# Altium project Project Kraken (The Ultimate ESP32-S3 dev board).PrjPcb (part 1 of 5)
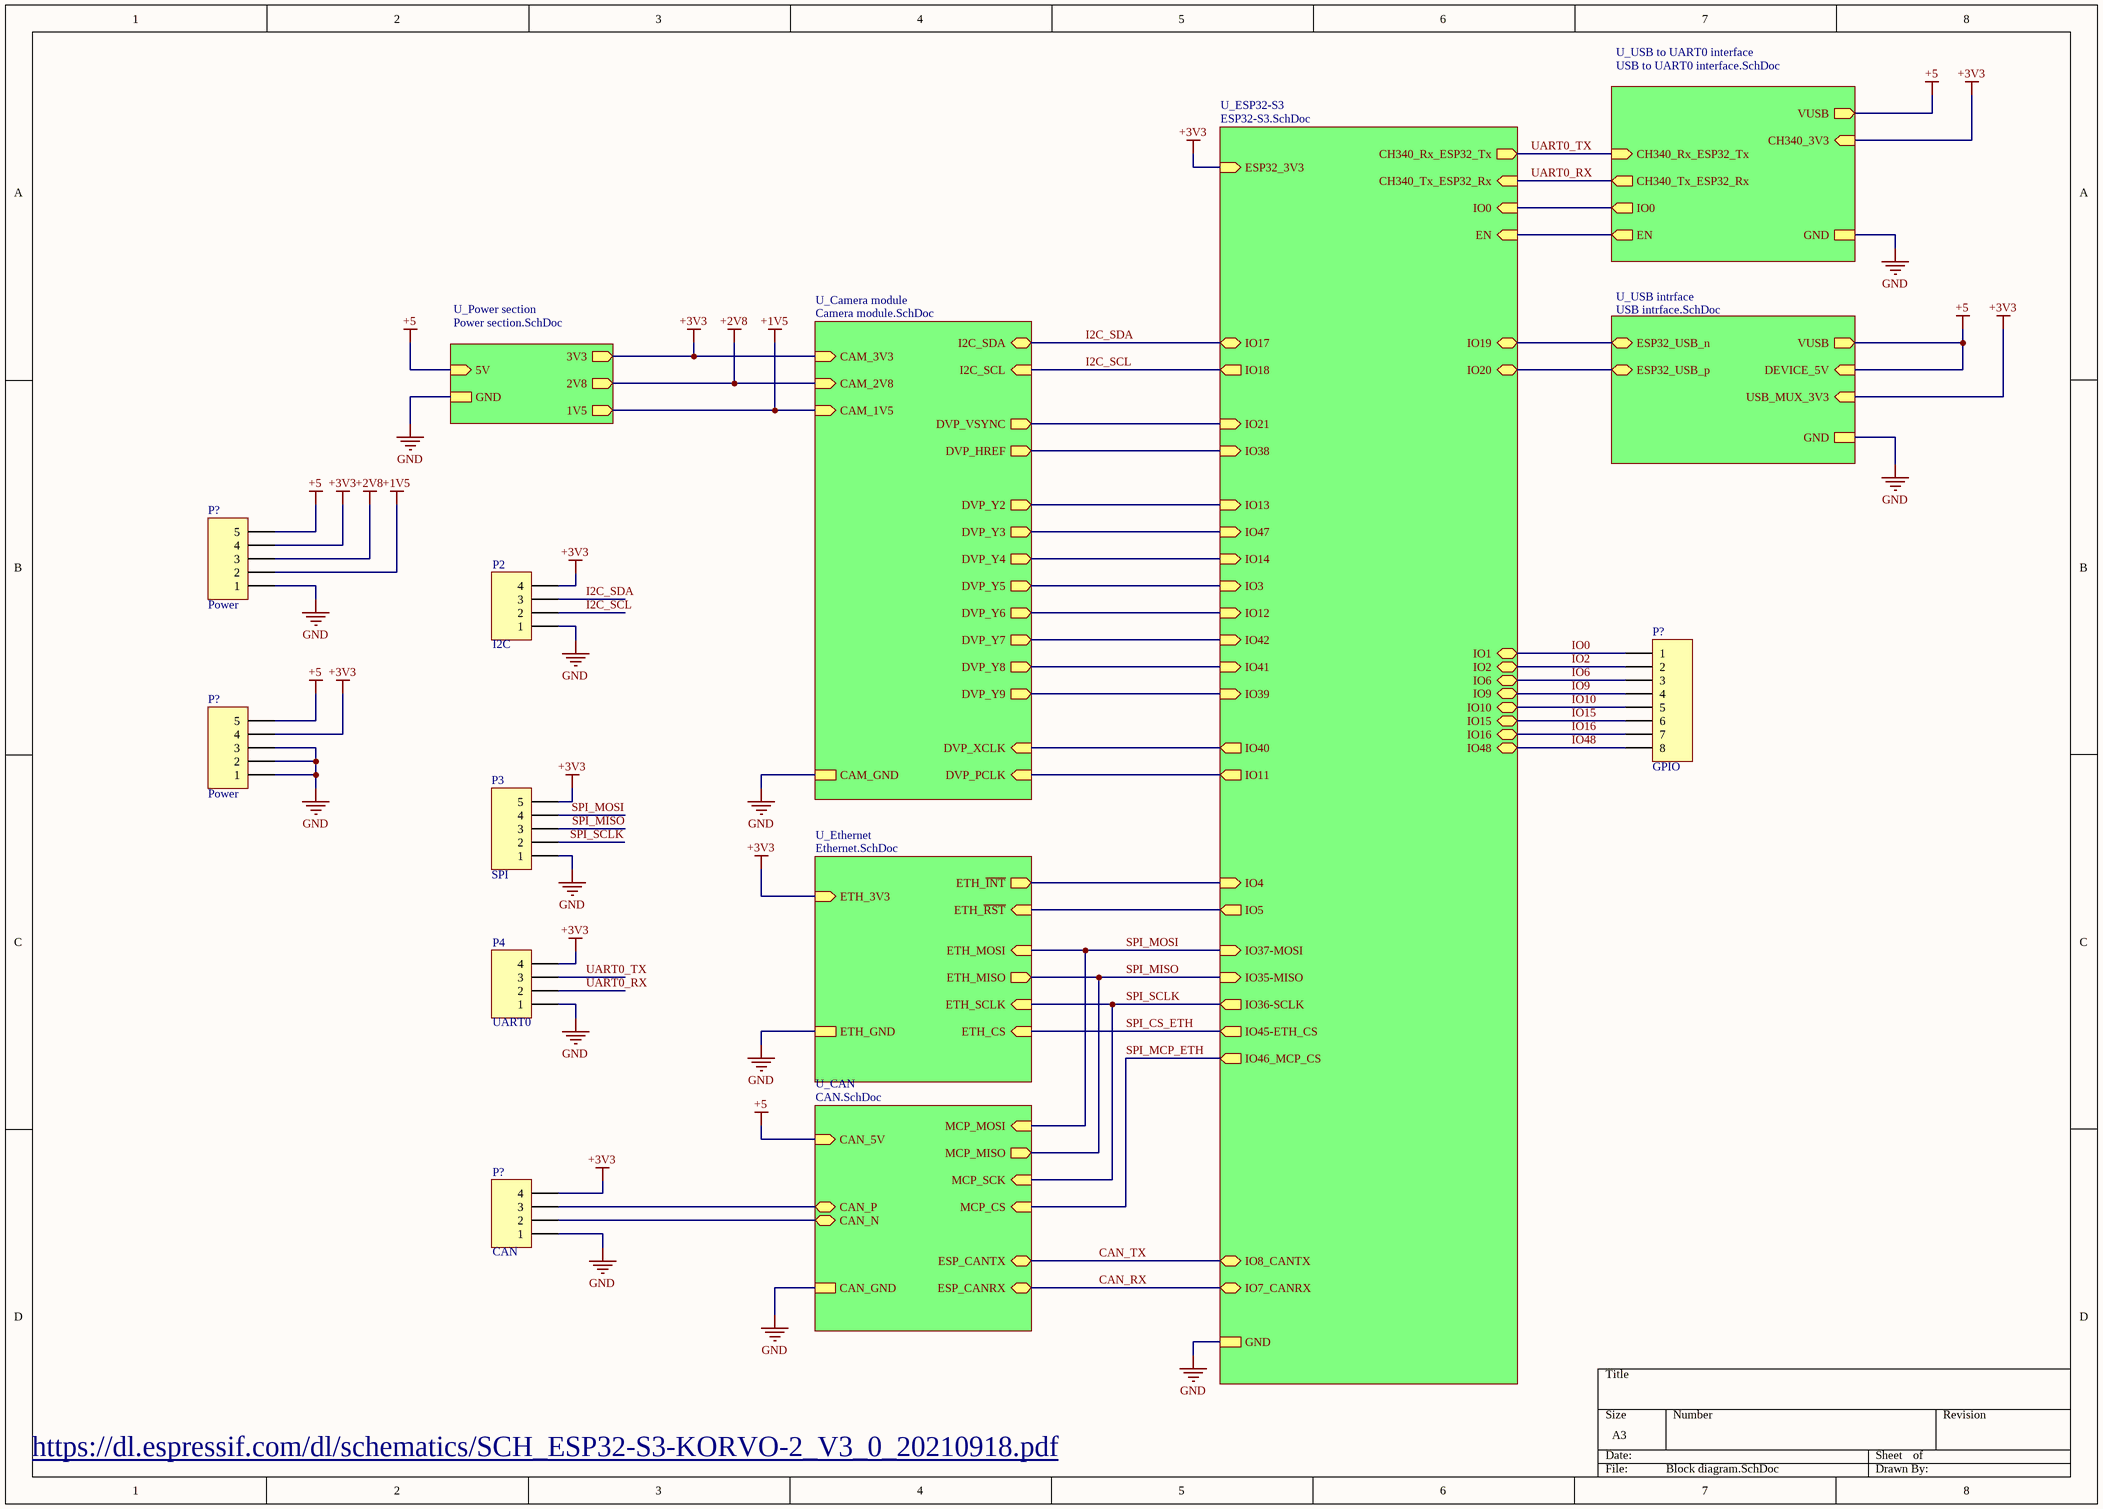
[diagram p0: Block diagram.SchDoc]
9 sheets, 156 parts. Net scope: hierarchical (ports join the sheet entries above them; power ports are global).
Board file: PCB1.PcbDoc
Sheets:
  Block diagram.SchDoc
    U_USB intrface = USB intrface.SchDoc
    U_Camera module = Camera module.SchDoc
    U_ESP32-S3 = ESP32-S3.SchDoc
    U_Power section = Power section.SchDoc
    U_Ethernet = Ethernet.SchDoc
    U_CAN = CAN.SchDoc
    U_USB to UART0 interface = USB to UART0 interface.SchDoc
  DAC.SchDoc

## Sheet Block diagram.SchDoc
size A3; SheetNumber: 1; SheetTotal: 9

### Parts
(Parts that share a designator on the sheet are numbered #1, #2 ... from top to bottom, then left to right.)
P2  I2C  [Header 2.54X4]
P3  SPI  [Header 2.54X5]
P4  UART0  [Header 2.54X4]
P?#1  Power  [Header 2.54X5]
P?#2  GPIO  [Header 2.54X8]
P?#3  Power  [Header 2.54X5]
P?#4  CAN  [Header 2.54X4]

### Sub-sheets
U_Camera module = Camera module.SchDoc: I2C_SDA (bidir), I2C_SCL (in), DVP_VSYNC (out), DVP_HREF (out), DVP_Y9 (out), DVP_XCLK (in), DVP_Y8 (out), DVP_Y7 (out), DVP_PCLK (in), DVP_Y6 (out), DVP_Y2 (out), DVP_Y5 (out), DVP_Y3 (out), DVP_Y4 (out), CAM_2V8 (in), CAM_GND, CAM_1V5 (in), CAM_3V3 (in)
U_CAN = CAN.SchDoc: MCP_SCK (in), MCP_MOSI (in), MCP_MISO (out), MCP_CS (in), ESP_CANTX (bidir), ESP_CANRX (bidir), CAN_5V (in), CAN_GND, CAN_P (bidir), CAN_N (bidir)
U_ESP32-S3 = ESP32-S3.SchDoc: CH340_Tx_ESP32_Rx (in), CH340_Rx_ESP32_Tx (out), IO1 (bidir), IO2 (bidir), IO3 (in), IO4 (in), IO5 (out), IO6 (bidir), IO7_CANRX (bidir), IO8_CANTX (bidir), IO9 (bidir), IO10 (bidir), IO11 (out), IO12 (in), IO13 (in), IO14 (in), IO15 (bidir), IO16 (bidir), EN (in), IO17 (bidir), IO18 (out), IO19 (bidir), IO20 (bidir), IO21 (in), IO35-MISO (in), IO36-SCLK (out), IO37-MOSI (in), IO38 (in), IO39 (in), IO40 (out), IO41 (in), IO42 (in), IO45-ETH_CS (out), IO46_MCP_CS (out), IO47 (in), IO48 (bidir), IO0 (in), GND, ESP32_3V3 (in)
U_Ethernet = Ethernet.SchDoc: ETH_~{RST} (in), ETH_~{INT} (out), ETH_MOSI (in), ETH_MISO (out), ETH_SCLK (in), ETH_CS (in), ETH_3V3 (in), ETH_GND
U_Power section = Power section.SchDoc: 2V8 (out), GND, 1V5 (out), 3V3 (out), 5V (in)
U_USB intrface = USB intrface.SchDoc: ESP32_USB_n (bidir), ESP32_USB_p (bidir), VUSB (out), GND, USB_MUX_3V3 (in), DEVICE_5V (in)
U_USB to UART0 interface = USB to UART0 interface.SchDoc: CH340_Tx_ESP32_Rx (out), CH340_Rx_ESP32_Tx (in), EN (out), IO0 (out), VUSB (out), GND, CH340_3V3 (in)

### Nets
+1V5: P?#1.2 ; sheet U_Camera module/CAM_1V5, sheet U_Power section/1V5
+2V8: P?#1.3 ; sheet U_Camera module/CAM_2V8, sheet U_Power section/2V8
+3V3: P2.4 P3.5 P4.4 P?#1.4 P?#3.4 P?#4.4 ; sheet U_USB intrface/USB_MUX_3V3, sheet U_Camera module/CAM_3V3, sheet U_ESP32-S3/ESP32_3V3, sheet U_Power section/3V3, sheet U_Ethernet/ETH_3V3, sheet U_USB to UART0 interface/CH340_3V3
+5: P?#1.5 P?#3.5 ; sheet U_USB intrface/VUSB, sheet U_USB intrface/DEVICE_5V, sheet U_Power section/5V, sheet U_CAN/CAN_5V, sheet U_USB to UART0 interface/VUSB
GND: P2.1 P3.1 P4.1 P?#1.1 P?#3.1 P?#3.2 P?#3.3 P?#4.1 ; sheet U_USB intrface/GND, sheet U_Camera module/CAM_GND, sheet U_ESP32-S3/GND, sheet U_Power section/GND, sheet U_Ethernet/ETH_GND, sheet U_CAN/CAN_GND, sheet U_USB to UART0 interface/GND
CAN_n: P?#4.2 ; sheet U_CAN/CAN_N
CAN_p: P?#4.3 ; sheet U_CAN/CAN_P
CAN_RX: sheet U_ESP32-S3/IO7_CANRX, sheet U_CAN/ESP_CANRX
CAN_TX: sheet U_ESP32-S3/IO8_CANTX, sheet U_CAN/ESP_CANTX
DVP_HREF: sheet U_Camera module/DVP_HREF, sheet U_ESP32-S3/IO38
DVP_PCLK: sheet U_Camera module/DVP_PCLK, sheet U_ESP32-S3/IO11
DVP_VSYNC: sheet U_Camera module/DVP_VSYNC, sheet U_ESP32-S3/IO21
DVP_XCLK: sheet U_Camera module/DVP_XCLK, sheet U_ESP32-S3/IO40
DVP_Y2: sheet U_Camera module/DVP_Y2, sheet U_ESP32-S3/IO13
DVP_Y3: sheet U_Camera module/DVP_Y3, sheet U_ESP32-S3/IO47
DVP_Y4: sheet U_Camera module/DVP_Y4, sheet U_ESP32-S3/IO14
DVP_Y5: sheet U_Camera module/DVP_Y5, sheet U_ESP32-S3/IO3
DVP_Y6: sheet U_Camera module/DVP_Y6, sheet U_ESP32-S3/IO12
DVP_Y7: sheet U_Camera module/DVP_Y7, sheet U_ESP32-S3/IO42
DVP_Y8: sheet U_Camera module/DVP_Y8, sheet U_ESP32-S3/IO41
DVP_Y9: sheet U_Camera module/DVP_Y9, sheet U_ESP32-S3/IO39
EN: sheet U_ESP32-S3/EN, sheet U_USB to UART0 interface/EN
ESP32_USB_n: sheet U_USB intrface/ESP32_USB_n, sheet U_ESP32-S3/IO19
ESP32_USB_p: sheet U_USB intrface/ESP32_USB_p, sheet U_ESP32-S3/IO20
ETH_~{INT}: sheet U_ESP32-S3/IO4, sheet U_Ethernet/ETH_~{INT}
ETH_~{RST}: sheet U_ESP32-S3/IO5, sheet U_Ethernet/ETH_~{RST}
I2C_SCL: P2.2 ; sheet U_Camera module/I2C_SCL, sheet U_ESP32-S3/IO18
I2C_SDA: P2.3 ; sheet U_Camera module/I2C_SDA, sheet U_ESP32-S3/IO17
IO0: P?#2.1 ; sheet U_ESP32-S3/IO1
IO0: sheet U_ESP32-S3/IO0, sheet U_USB to UART0 interface/IO0  [a separate net that carries the same name]
IO2: P?#2.2 ; sheet U_ESP32-S3/IO2
IO6: P?#2.3 ; sheet U_ESP32-S3/IO6
IO9: P?#2.4 ; sheet U_ESP32-S3/IO9
IO10: P?#2.5 ; sheet U_ESP32-S3/IO10
IO15: P?#2.6 ; sheet U_ESP32-S3/IO15
IO16: P?#2.7 ; sheet U_ESP32-S3/IO16
IO48: P?#2.8 ; sheet U_ESP32-S3/IO48
SPI_CS_ETH: sheet U_ESP32-S3/IO45-ETH_CS, sheet U_Ethernet/ETH_CS  [project net ETH_CS]
SPI_MCP_ETH: sheet U_ESP32-S3/IO46_MCP_CS, sheet U_CAN/MCP_CS  [project net IO46]
SPI_MISO: P3.3 ; sheet U_ESP32-S3/IO35-MISO, sheet U_Ethernet/ETH_MISO, sheet U_CAN/MCP_MISO  [project net ETH_MISO]
SPI_MOSI: P3.4 ; sheet U_ESP32-S3/IO37-MOSI, sheet U_Ethernet/ETH_MOSI, sheet U_CAN/MCP_MOSI  [project net ETH_MOSI]
SPI_SCLK: P3.2 ; sheet U_ESP32-S3/IO36-SCLK, sheet U_Ethernet/ETH_SCLK, sheet U_CAN/MCP_SCK  [project net ETH_SCLK]
UART0_RX: P4.2 ; sheet U_ESP32-S3/CH340_Tx_ESP32_Rx, sheet U_USB to UART0 interface/CH340_Tx_ESP32_Rx  [project net CH340_Tx_ESP32_Rx]
UART0_TX: P4.3 ; sheet U_ESP32-S3/CH340_Rx_ESP32_Tx, sheet U_USB to UART0 interface/CH340_Rx_ESP32_Tx  [project net CH340_Rx_ESP32_Tx]

### Notes on the sheet
- https://dl.espressif.com/dl/schematics/SCH_ESP32-S3-KORVO-2_V3_0_20210918.pdf

### Library data of the parts
P2 P4 P?#4 = Connector Pinheader 1x4: Header_4x1
P3 P?#1 P?#3 = Connector Pinheader 1x5: Header_5x1
P?#2 = Connector Pinheader 1x8: Header_8x1

## Sheet USB intrface.SchDoc
size A3; SheetNumber: 4; SheetTotal: 9
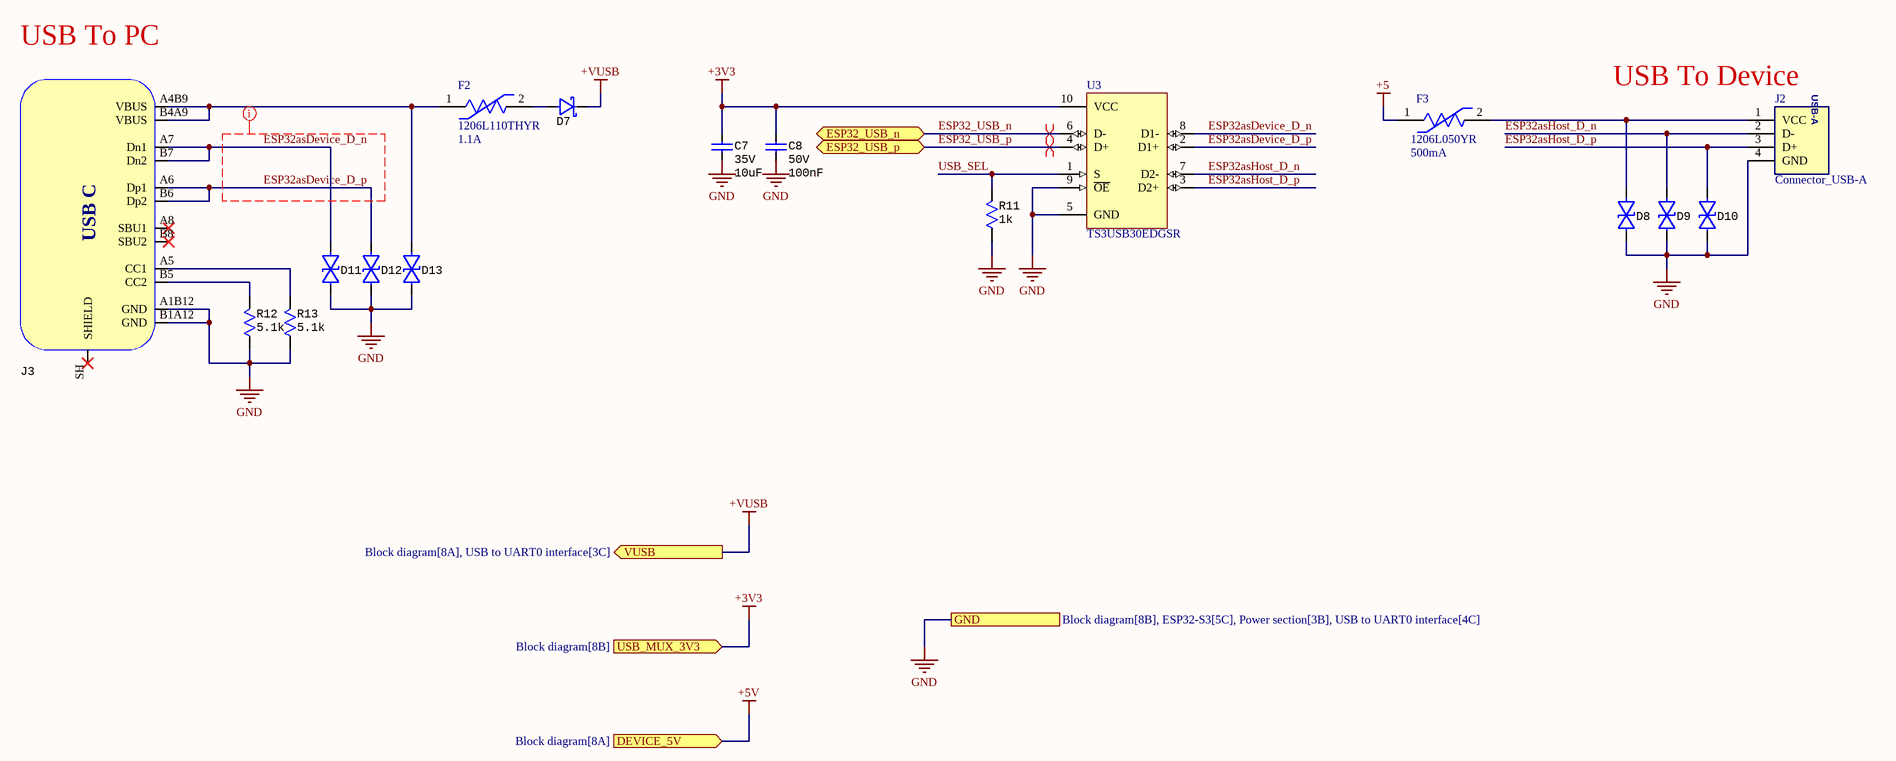
[diagram p1: USB intrface.SchDoc]

### Parts
C7  Voltage: 35V  [CAP Ceramic SMD 0603]  (hidden comment: 10uF)
C8  Voltage: 50V  [CAP Ceramic SMD 0603]  (hidden comment: 100nF)
D7  (no value)  [Diode Single SMD SOD123]
D8  (no value)  [Diode Single SMD SOD523]
D9  (no value)  [Diode Single SMD SOD523]
D10  (no value)  [Diode Single SMD SOD523]
D11  (no value)  [Diode Single SMD SOD523]
D12  (no value)  [Diode Single SMD SOD523]
D13  (no value)  [Diode Single SMD SOD523]
F2  1206L110THYR  Hold Current: 1.1A  [FUSE-1206]
F3  1206L050YR  Hold Current: 500mA  [FUSE-1206]
J2  Connector_USB-A  [USB-A/S_A]
J3  Connector_USB_Type_C_12Pin  [USB-C-31-M-12 (12PIN)]  (value not drawn)
R11  value 1k  [RES SMD 0603]  (hidden comment: 1kR)
R12  value 5.1k  [RES SMD 0603]  (hidden comment: 5.1kR)
R13  value 5.1k  [RES SMD 0603]  (hidden comment: 5.1kR)
U3  TS3USB30EDGSR  [VSSOP-10 _N]

### Ports
DEVICE_5V (in, see Block diagram[8A]), ESP32_USB_n (bidir, see Block diagram[7A]), ESP32_USB_p (bidir, see Block diagram[7A]), GND (see Block diagram[8B], ESP32-S3[5C], Power section[3B], USB to UART0 interface[4C]), USB_MUX_3V3 (in, see Block diagram[8B]), VUSB (out, see Block diagram[8A], USB to UART0 interface[3C])

### Nets
+3V3: C7.1 C8.1 U3.10(VCC) ; port USB_MUX_3V3
+5: D7.2 F3.1 ; port VUSB, port DEVICE_5V  [also labelled +5V, +VUSB]
GND: C7.2 C8.2 D8.1 D9.1 D10.1 D11.1 D12.1 D13.1 J2.4(GND) J3.A1B12(GND) J3.B1A12(GND) R11.1 R12.1 R13.1 U3.5(GND) U3.9(~{OE}) ; port GND
ESP32_USB_n: U3.6(D-) ; port ESP32_USB_n
ESP32_USB_p: U3.4(D+) ; port ESP32_USB_p
ESP32asDevice_D_n: D11.2 J3.A7(Dn1) J3.B7(Dn2) U3.8(D1-)
ESP32asDevice_D_p: D12.2 J3.A6(Dp1) J3.B6(Dp2) U3.2(D1+)
ESP32asHost_D_n: D9.2 J2.2(D-) U3.7(D2-)
ESP32asHost_D_p: D10.2 J2.3(D+) U3.3(D2+)
USB_SEL: R11.2 U3.1(S)
NetD7_1: D7.1 F2.2
NetD8_2: D8.2 F3.2 J2.1(VCC)
NetD13_2: D13.2 F2.1 J3.A4B9(VBUS) J3.B4A9(VBUS)
NetJ3_A5: J3.A5(CC1) R13.2
NetJ3_B5: J3.B5(CC2) R12.2

Not connected (* = marked no-connect by the designer): J3 A8(SBU1)* B8(SBU2)* SH(SHIELD)*

### Layout directives
differential pair: ESP32_USB_n, ESP32_USB_p
net class Diff90Ohm: ESP32asDevice_D_n, ESP32asDevice_D_p

### Notes on the sheet
- USB To PC
- (near J2) USB To Device
- (in symbol Connector_USB-A) USB-A
- (in symbol Connector_USB_Type_C_12Pin) USB C

### Library data of the parts
C7 = CAP 0603 10uF 35V: Cap Ceramic 10uF 35V X5R 20% Pad SMD 0603 85C T/R; Manufacturer: Murata; Manufacturer Part Number: GRM188R6YA106MA73D; Supplier 1: LCSC; RoHS: Yes; Category: Ceramic Capacitors; Mount: Surface Mount; Case/Package: 0603; Case Code (Metric): 1608; Case Code (Imperial): 0603; Min Operating Temperature: -55°C; Max Operating Temperature: 85°C; Packaging: Tape and Reel; Capacitance: 10uF; Voltage Rating: 35V; Tolerance: 20%; Dielectric: X5R; Voltage Rating (DC): 35V; Length: 0.063inch; Width: 0.031inch; Thickness: 0.039inch; RoHS Compliant: Yes; ComponentLink1URL: http://search.murata.co.jp/Ceramy/image/img/A01X/G101/ENG/GRM188R6YA106MA73-01.pdf?src-supplier=Future+Electronics; ComponentLink1Description: http://search.murata.co.jp/Ceramy/image/img/A01X/G101/ENG/GRM188R6YA106MA73-01.pdf?src-supplier=Future+Electronics; ComponentLink2URL: http://search.murata.co.jp/Ceramy/image/img/A01X/G101/ENG/GRM188R6YA106MA73-01.pdf?src-supplier=Digi-Key; ComponentLink2Description: http://search.murata.co.jp/Ceramy/image/img/A01X/G101/ENG/GRM188R6YA106MA73-01.pdf?src-supplier=Digi-Key; ComponentLink3URL: https://www.murata.com/~/media/webrenewal/support/library/catalog/products/capacitor/mlcc/c02e.ashx?la=en-us&src-supplier=Digi-Key; ComponentLink3Description: https://www.murata.com/~/media/webrenewal/support/library/catalog/products/capacitor/mlcc/c02e.ashx?la=en-us&src-supplier=Digi-Key; ComponentLink4URL: http://search.murata.co.jp/Ceramy/image/img/A01X/G101/ENG/GRM188R6YA106MA73-01.pdf?src-supplier=Mouser; ComponentLink4Description: http://search.murata.co.jp/Ceramy/image/img/A01X/G101/ENG/GRM188R6YA106MA73-01.pdf?src-supplier=Mouser; ComponentLink5URL: http://search.murata.co.jp/Ceramy/image/img/A01X/G101/ENG/GRM188R6YA106MA73-01.pdf?src-supplier=TTI; ComponentLink5Description: http://search.murata.co.jp/Ceramy/image/img/A01X/G101/ENG/GRM188R6YA106MA73-01.pdf?src-supplier=TTI; Supplier Part Number 1: C194427; Value: 10uF
C8 = CAP 0603 100nF 50V: Multilayer Ceramic Capacitors MLCC Surface Mount 0603 0.1uF 50 Volts X7R 10%; Manufacturer: Murata; Manufacturer Part Number: GRM188R71H104KA93D; Insulation Resistance: 10GR; Supplier 1: LCSC; RoHS: Yes; Category: Ceramic Capacitors; Stock 1: 3546650; Pricing 1: 50=0.00420, 500=0.00330, 1500=0.00290, 5000=0.00260, 25000=0.00250, 50000=0.00240 (USD); Mount: Surface Mount; Case/Package: 0603; Number of Pins: 2; Case Code (Imperial): 0603; Case Code (Metric): 1608; Dielectric Material: Ceramic; Material: Ceramic; Contact Plating: Tin,Matte; Min Operating Temperature: -55°C; Max Operating Temperature: 125°C; Capacitance: 100nF; Tolerance: 10%; Packaging: Tape and Reel; Dielectric: X7R; Voltage Rating (DC): 50V; Termination: SMD/SMT; Package Quantity: 1; Voltage Rating: 50V; Length: 1.6mm; Width: 0.8mm; Height: 0.8mm; Depth: 0.8mm; Thickness: 0.035inch; Radiation Hardening: No; RoHS Compliant: Yes; REACH SVHC: No SVHC; Lead Free: Lead Free; ComponentLink1URL: https://datasheet.ciiva.com/19467/1857604-19467681.pdf?src-supplier=Jameco; ComponentLink1Description: https://datasheet.ciiva.com/19467/1857604-19467681.pdf?src-supplier=Jameco; ComponentLink2URL: https://datasheet.ciiva.com/11786/0900766b807a1cab-11786047.pdf?src-supplier=RSComponents; ComponentLink2Description: https://datasheet.ciiva.com/11786/0900766b807a1cab-11786047.pdf?src-supplier=RSComponents; ComponentLink3URL: https://datasheet.ciiva.com/29201/451744-da-01-en-vs-kondensator-0603-29201904.pdf?src-supplier=Conrad; ComponentLink3Description: https://datasheet.ciiva.com/29201/451744-da-01-en-vs-kondensator-0603-29201904.pdf?src-supplier=Conrad; ComponentLink4URL: https://datasheet.ciiva.com/7937/4360-7937659.pdf?src-supplier=Element14; ComponentLink4Description: https://datasheet.ciiva.com/7937/4360-7937659.pdf?src-supplier=Element14; ComponentLink5URL: https://datasheet.ciiva.com/14116/nmgrm-data-en-14116602.pdf?src-supplier=Distrelec; ComponentLink5Description: https://datasheet.ciiva.com/14116/nmgrm-data-en-14116602.pdf?src-supplier=Distrelec; ComponentLink6URL: https://datasheet.ciiva.com/48436/nmgrm-data-en-48436667.pdf?src-supplier=Distrelec; ComponentLink6Description: https://datasheet.ciiva.com/48436/nmgrm-data-en-48436667.pdf?src-supplier=Distrelec; ComponentLink7URL: https://datasheet.ciiva.com/28534/4360-28534245.pdf?src-supplier=Element14; ComponentLink7Description: https://datasheet.ciiva.com/28534/4360-28534245.pdf?src-supplier=Element14; ComponentLink8URL: https://datasheet.ciiva.com/131/partnumbering-e-01-131739.pdf?src-supplier=Digi-Key; ComponentLink8Description: https://datasheet.ciiva.com/131/partnumbering-e-01-131739.pdf?src-supplier=Digi-Key; ComponentLink9URL: https://datasheet.ciiva.com/131/partnumbering-e-01-131738.pdf?src-supplier=Digi-Key; ComponentLink9Description: https://datasheet.ciiva.com/131/partnumbering-e-01-131738.pdf?src-supplier=Digi-Key; ComponentLink10URL: https://datasheet.ciiva.com/131/partnumbering-e-01-131740.pdf?src-supplier=Digi-Key; ComponentLink10Description: https://datasheet.ciiva.com/131/partnumbering-e-01-131740.pdf?src-supplier=Digi-Key; ComponentLink11URL: https://datasheet.ciiva.com/7937/1747470-7937658.pdf?src-supplier=Element14; ComponentLink11Description: https://datasheet.ciiva.com/7937/1747470-7937658.pdf?src-supplier=Element14; Supplier Part Number 1: C77055; Value: 100nF
D7 = B5819W: 40V 600mV@1A 1A SOD-123 Schottky Barrier Diodes (SBD) ROHS; Manufacturer: MCC; Manufacturer Part Number: B5819W-TP; Element Configuration: Single; Forward Voltage: 550mV; Max Reverse Voltage (DC): 20V; Max Forward Surge Current (Ifsm): 10A; Max Reverse Current: 1mA; Max Power Dissipation: 250mW; Supplier 1: LCSC; RoHS: Yes; Category: Rectifier Diodes; Stock 1: 8570; Pricing 1: 10=0.04150, 100=0.03440, 300=0.03090, 3000=0.02820, 6000=0.02610, 9000=0.02500 (USD); Mount: Surface Mount; Min Operating Temperature: -65°C; Max Operating Temperature: 125°C; Package Quantity: 3000; Packaging: Tape and Reel; Average Rectified Current: 1A; Series: -; Reverse Voltage (DC): 40V; Forward Current: 1A; Max Repetitive Reverse Voltage (Vrrm): 40V; RoHS Compliant: Yes; ComponentLink1URL: https://datasheet.ciiva.com/6378/b5817w-b5819wsod-123-6378255.pdf?src-supplier=Digi-Key; ComponentLink1Description: https://datasheet.ciiva.com/6378/b5817w-b5819wsod-123-6378255.pdf?src-supplier=Digi-Key; Supplier Part Number 1: C84354
D8-D13 = LESD5D5.0CT1G: Bi-Directional 9.4A 5V 18.6V 5.6V SOD-523 ESD Protection Devices ROHS; Manufacturer: UMW(Youtai Semiconductor); Supplier 1: LCSC; Manufacturer Part Number: LESD5D5.0CT1G; RoHS: No; Category: Uncategorized; Stock 1: 13940; Pricing 1: 20=0.02140, 200=0.01710, 600=0.01470, 3000=0.01330, 9000=0.01330, 21000=0.01330 (USD); Supplier Part Number 1: C5199850
F2 = 1206L110THYR: PTC RESET FUSE 8V 1.1A 1206; Manufacturer: Littelfuse; Trip Time: 0.1s; Trip Current: 2.2A; Value: 0.04-0.21Ω; Current Rating: 100A; Voltage Rating: 8V; Device Class L3: unset; Manufacturer Part Number: 1206L110THYR; ComponentLink2URL: https://m.littelfuse.com/~/media/electronics/datasheets/resettable_ptcs/littelfuse_ptc_1206l_datasheet.pdf.pdf; Height: 0.6mm; Temperature Range Low: -40°C; Automotive: No; Device Class L2: PTC Resettable Fuses; Device Class L1: Circuit Protection; Digikey Description: PTC RESET FUSE 8V 1.1A 1206; Octopart: https://octopart.com/1206l110thyr-littelfuse-11800142; Temperature Range High: +85°C; Category: Fuse; RoHS: TRUE; Ambient Temperature Range Low: -40°C; Mouser Description: Resettable Fuses - PPTC PTC 8V 1206 1.1A POLYFUSE SMD THIN; ComponentLink2Description: Datasheet; Ambient Temperature Range High: +85°C; Lead Free: Yes; Resistance: 0.04-0.21Ω; Temperature: -40°C to +85°C; Package: 1206L
F3 = 1206L050YR: PTC RESET FUSE 6V 500MA 1206; Trip Current: 1A; Current Rating: 100A; Resistance: 700mR; Approvals: cULus; Max Power Dissipation: 600mW; Time to Trip: 0.1s; Min Operating Temperature: -40°C; Voltage Rating (DC): 6V; Working Voltage: 6V; Package Quantity: 4000; Termination: SMD/SMT; Lead Free: Lead Free; REACH SVHC: No SVHC; Series: 1206L; Max Voltage Rating (DC): 6V; Height: 0.75mm; Terminal Material: Copper; Packaging: Tape and Reel; Case Code (Imperial): 1206; Length: 3.4mm; RoHS Compliant: Yes; Operating Supply Voltage: 6V; Case Code (Metric): 3216; Width: 1.8mm; Max Current Rating: 100A; Case/Package: 1206; Power Dissipation: 600mW; Max Operating Temperature: 85°C; Voltage Rating: 6V
J3 = Connector_USB_Type_C_12Pin: Korean Hroparts Elec / USB-Type-C / Num of contacts 16 / Surface Mount; ManufacturerPartNumber: TYPE-C-31-M-12; SuplierPartNumber: C165948; TypeConnector: USB Type C; CurrentMax: 3A; Manufacturer: Korean Hroparts; HelpURL: https://lcsc.com/product-detail/USB-Type-C_Korean-Hroparts-Elec-TYPE-C-31-M-12_C165948.html
R11 = RES 0603 1k 1%: Res Thick Film 0603 1K Ohm 1% 1/10W ±100ppm/°C Molded SMD Punched Carrier T/R; Manufacturer: Panasonic; Manufacturer Part Number: ERJ3EKF1001V; Power Rating: 100mW; Voltage Rating: 75V; Supplier 1: LCSC; RoHS: Yes; Category: Chip SMD Resistors; Stock 1: 79650; Pricing 1: 50=0.009600, 500=0.008100, 1500=0.007300, 5000=0.006800, 25000=0.006400, 50000=0.006200 (AUD); Mount: Surface Mount; Case/Package: 0603; Number of Pins: 2; Case Code (Metric): 1608; Case Code (Imperial): 0603; Contact Plating: Tin; Size Code: 0603; Min Operating Temperature: -55°C; Max Operating Temperature: 155°C; Packaging: Tape and Reel; Resistance: 1kR; Resistor Type: Thick Film; Temperature Coefficient: 100ppm/°C; Series: ERJ; Tolerance: 1%; Number of Terminations: 2; Max Power Dissipation: 100mW; Construction: Rectangular; Features: Automotive AEC-Q200; Package Quantity: 5000; Termination: SMD/SMT; Voltage Rating (DC): 75V; Resistance Tolerance: 1%; Technology: THICK FILM; Length: 1.6mm; Width: 0.8mm; Height: 0.45mm; Depth: 0.8mm; Radiation Hardening: No; RoHS Compliant: Yes; Lead Free: Lead Free; Military Standard: Not; REACH SVHC: No SVHC; ComponentLink1URL: https://datasheet.ciiva.com/7942/aoa0000ce2-7942427.pdf?src-supplier=Element14; ComponentLink1Description: https://datasheet.ciiva.com/7942/aoa0000ce2-7942427.pdf?src-supplier=Element14; ComponentLink2URL: https://datasheet.ciiva.com/46373/1678782-46373340.pdf?src-supplier=Element14; ComponentLink2Description: https://datasheet.ciiva.com/46373/1678782-46373340.pdf?src-supplier=Element14; ComponentLink3URL: https://datasheet.ciiva.com/22673/1678782-22673918.pdf?src-supplier=Element14; ComponentLink3Description: https://datasheet.ciiva.com/22673/1678782-22673918.pdf?src-supplier=Element14; ComponentLink4URL: https://datasheet.ciiva.com/46373/1678782-46373339.pdf?src-supplier=Element14; ComponentLink4Description: https://datasheet.ciiva.com/46373/1678782-46373339.pdf?src-supplier=Element14; ComponentLink5URL: https://datasheet.ciiva.com/24070/aoa0000ce2-24070269.pdf?src-supplier=Mouser; ComponentLink5Description: https://datasheet.ciiva.com/24070/aoa0000ce2-24070269.pdf?src-supplier=Mouser; ComponentLink6URL: https://datasheet.ciiva.com/16768/70260748-16768437.pdf?src-supplier=Allied+Electronics; ComponentLink6Description: https://datasheet.ciiva.com/16768/70260748-16768437.pdf?src-supplier=Allied+Electronics; ComponentLink7URL: https://datasheet.ciiva.com/16774/70260748-16774550.pdf?src-supplier=Allied+Electronics; ComponentLink7Description: https://datasheet.ciiva.com/16774/70260748-16774550.pdf?src-supplier=Allied+Electronics; ComponentLink8URL: https://datasheet.ciiva.com/9198/aoa0000ce2-9198923.pdf?src-supplier=Avnet; ComponentLink8Description: https://datasheet.ciiva.com/9198/aoa0000ce2-9198923.pdf?src-supplier=Avnet; ComponentLink9URL: https://datasheet.ciiva.com/16449/aoa0000ce2-16449065.pdf?src-supplier=Future+Electronics; ComponentLink9Description: https://datasheet.ciiva.com/16449/aoa0000ce2-16449065.pdf?src-supplier=Future+Electronics; ComponentLink10URL: https://datasheet.ciiva.com/48530/aoa0000ce2-48530987.pdf?src-supplier=Avnet; ComponentLink10Description: https://datasheet.ciiva.com/48530/aoa0000ce2-48530987.pdf?src-supplier=Avnet; ComponentLink11URL: https://datasheet.ciiva.com/30063/aoa0000ce2-30063390.pdf?src-supplier=Onlinecomponents.com; ComponentLink11Description: https://datasheet.ciiva.com/30063/aoa0000ce2-30063390.pdf?src-supplier=Onlinecomponents.com; Supplier Part Number 1: C118155
R12 R13 = RES 0603 5.1k 1%: Res Thick Film 0603 5.1K Ohm 1% 1/10W ±100ppm/°C Molded SMD SMD Paper T/R; Manufacturer: Vishay; Manufacturer Part Number: CRCW06035K10FKEA; Max Power Dissipation: 100mW; Voltage Rating (DC): 75V; Supplier 1: LCSC; RoHS: Yes; Category: Chip SMD Resistors; Stock 1: 3800; Pricing 1: 50=0.017200, 500=0.013100, 1500=0.011300, 5000=0.010700, 25000=0.009300, 50000=0.009200 (AUD); Mount: Surface Mount; Case/Package: 0603; Case Code (Imperial): 0603; Case Code (Metric): 1608; Contact Plating: Tin; Size Code: 0603; Weight: 7.1E-05oz; Min Operating Temperature: -55°C; Max Operating Temperature: 155°C; Packaging: Tape and Reel; Resistance: 5.1kR; Tolerance: 1%; Temperature Coefficient: 100ppm/°C; Resistor Type: Thick Film; Series: CRCW; Number of Terminations: 2; Package Quantity: 5000; Power Rating: 100mW; Voltage Rating: 75V; Construction: Rectangular; Features: Automotive AEC-Q200; Termination: SMD/SMT; Resistance Tolerance: 1%; Technology: THICK FILM; Length: 1.55mm; Width: 0.85mm; Height: 0.45mm; Depth: 0.85mm; Radiation Hardening: No; RoHS Compliant: Yes; Lead Free: Lead Free; Military Standard: Not; REACH SVHC: Unknown; ComponentLink1URL: https://datasheet.ciiva.com/11809/0900766b80d98afc-11809935.pdf?src-supplier=RSComponents; ComponentLink1Description: https://datasheet.ciiva.com/11809/0900766b80d98afc-11809935.pdf?src-supplier=RSComponents; ComponentLink2URL: https://datasheet.ciiva.com/26314/fld-crcw-e3-data-en-26314742.pdf?src-supplier=Distrelec; ComponentLink2Description: https://datasheet.ciiva.com/26314/fld-crcw-e3-data-en-26314742.pdf?src-supplier=Distrelec; ComponentLink3URL: https://datasheet.ciiva.com/7690/1697337-7690728.pdf?src-supplier=Element14; ComponentLink3Description: https://datasheet.ciiva.com/7690/1697337-7690728.pdf?src-supplier=Element14; ComponentLink4URL: https://datasheet.ciiva.com/7690/1720486-7690873.pdf?src-supplier=Element14; ComponentLink4Description: https://datasheet.ciiva.com/7690/1720486-7690873.pdf?src-supplier=Element14; ComponentLink5URL: https://datasheet.ciiva.com/15159/getdatasheetpartid-32793-15159338.pdf?src-supplier=Verical; ComponentLink5Description: https://datasheet.ciiva.com/15159/getdatasheetpartid-32793-15159338.pdf?src-supplier=Verical; ComponentLink6URL: https://datasheet.ciiva.com/3257/dcrcwe3-3257758.pdf?src-supplier=Avnet; ComponentLink6Description: https://datasheet.ciiva.com/3257/dcrcwe3-3257758.pdf?src-supplier=Avnet; ComponentLink7URL: https://datasheet.ciiva.com/16226/dcrcwe3-16226862.pdf?src-supplier=Future+Electronics; ComponentLink7Description: https://datasheet.ciiva.com/16226/dcrcwe3-16226862.pdf?src-supplier=Future+Electronics; Supplier Part Number 1: C844933
U3 = TS3USB30EDGSR: High-Speed USB 2.0 (480-Mbps) 1:2 Multiplexer / Demultiplexer Switch with Single, 10 ohm RON, 3.0 to 4.3V, -40 to 85 degC, 10-Pin MSOP (DGS), Green (RoHS & no Sb/Br); Manufacturer: Texas Instruments; Architecture: "1","2 mux/demux"; tpd max(ns): 0.25; ICC(uA): 1; IL OFF(Max)(nA): 2; OFF Time(Max)(ns): 30; SubFamily: USB Switch; ESD HBM(kV): +/-8; Bandwidth(MHz): 900; RON Mis-match(Max)(Ohms): 0.35; ON Time(Max)(ns): 25; ron(max)(ohms): 10; PartNumber: TS3USB30EDGSR; ComponentLink1URL: http://www.ti.com/general/docs/lit/getliterature.tsp?genericPartNumber=TS3USB30E&fileType=pdf; Vcc range(V): 3.0 to 4.3; PackageReference: DGS0010A; Code_JEDEC: MO-187-BA; PackageDescription: 10-Pin Thin Shrink Small Outline Package 0.5 mm Pitch; Eco-Plan: Green (RoHS & no Sb/Br); ComponentLink2URL: http://www.ti.com/litv/pdf/mpds035b; Number of Channels: 2; Mounting Technology: Surface Mount; PackageVersion: revC, Feb-2004; DatasheetVersion: SCDS255D; ComponentLink1Description: Datasheet; ComponentLink2Description: Package Specification; RON Flatness(Max)(Ohms): 2

## Sheet Camera module.SchDoc
size A3; SheetNumber: 6; SheetTotal: 9
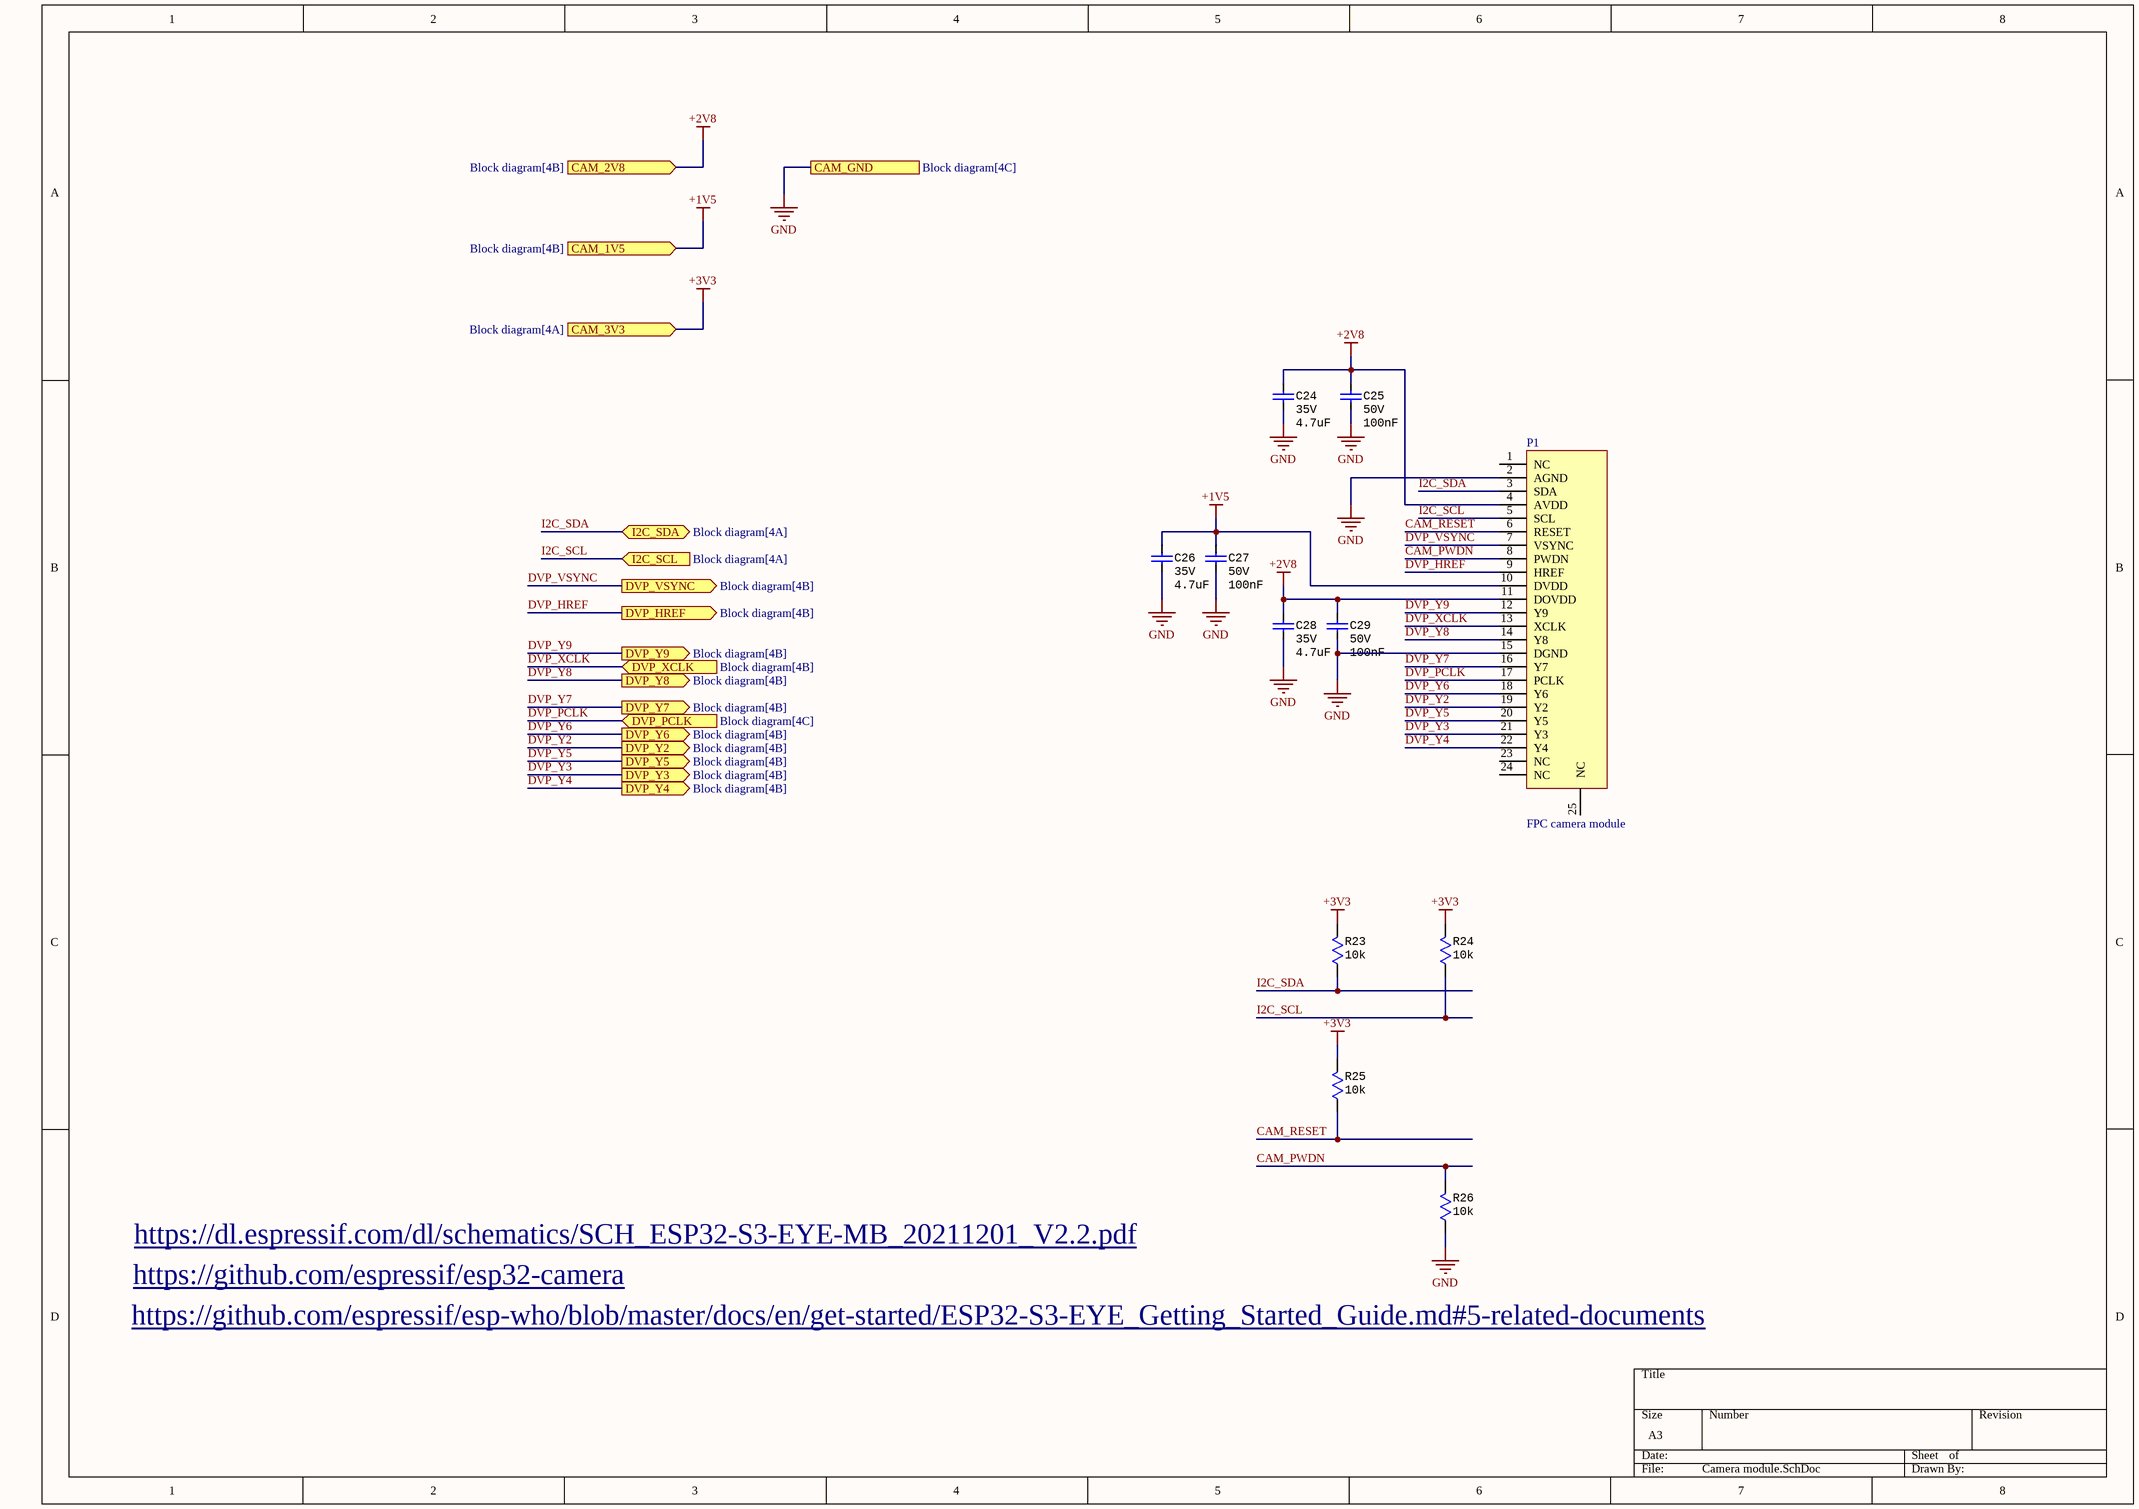
[diagram p2: Camera module.SchDoc]

### Parts
C24  Voltage: 35V  [CAP Ceramic SMD 0603]  (hidden comment: 4.7uF)
C25  Voltage: 50V  [CAP Ceramic SMD 0603]  (hidden comment: 100nF)
C26  Voltage: 35V  [CAP Ceramic SMD 0603]  (hidden comment: 4.7uF)
C27  Voltage: 50V  [CAP Ceramic SMD 0603]  (hidden comment: 100nF)
C28  Voltage: 35V  [CAP Ceramic SMD 0603]  (hidden comment: 4.7uF)
C29  Voltage: 50V  [CAP Ceramic SMD 0603]  (hidden comment: 100nF)
P1  FPC camera module  [FPC24 Camera Module]
R23  value 10k  [RES SMD 0603]  (hidden comment: 10kR)
R24  value 10k  [RES SMD 0603]  (hidden comment: 10kR)
R25  value 10k  [RES SMD 0603]  (hidden comment: 10kR)
R26  value 10k  [RES SMD 0603]  (hidden comment: 10kR)

### Ports
CAM_1V5 (in, see Block diagram[4B]), CAM_2V8 (in, see Block diagram[4B]), CAM_3V3 (in, see Block diagram[4A]), CAM_GND (see Block diagram[4C]), DVP_HREF (out, see Block diagram[4B]), DVP_PCLK (in, see Block diagram[4C]), DVP_VSYNC (out, see Block diagram[4B]), DVP_XCLK (in, see Block diagram[4B]), DVP_Y2 (out, see Block diagram[4B]), DVP_Y3 (out, see Block diagram[4B]), DVP_Y4 (out, see Block diagram[4B]), DVP_Y5 (out, see Block diagram[4B]), DVP_Y6 (out, see Block diagram[4B]), DVP_Y7 (out, see Block diagram[4B]), DVP_Y8 (out, see Block diagram[4B]), DVP_Y9 (out, see Block diagram[4B]), I2C_SCL (in, see Block diagram[4A]), I2C_SDA (bidir, see Block diagram[4A])

### Nets
+1V5: C26.1 C27.1 P1.10(DVDD) ; port CAM_1V5
+2V8: C24.1 C25.1 C28.1 C29.1 P1.4(AVDD) P1.11(DOVDD) ; port CAM_2V8
+3V3: R23.2 R24.2 R25.2 ; port CAM_3V3
GND: C24.2 C25.2 C26.2 C27.2 C28.2 C29.2 P1.2(AGND) P1.15(DGND) R26.1 ; port CAM_GND
CAM_PWDN: P1.8(PWDN) R26.2
CAM_RESET: P1.6(RESET) R25.1
DVP_HREF: P1.9(HREF) ; port DVP_HREF
DVP_PCLK: P1.17(PCLK) ; port DVP_PCLK
DVP_VSYNC: P1.7(VSYNC) ; port DVP_VSYNC
DVP_XCLK: P1.13(XCLK) ; port DVP_XCLK
DVP_Y2: P1.19(Y2) ; port DVP_Y2
DVP_Y3: P1.21(Y3) ; port DVP_Y3
DVP_Y4: P1.22(Y4) ; port DVP_Y4
DVP_Y5: P1.20(Y5) ; port DVP_Y5
DVP_Y6: P1.18(Y6) ; port DVP_Y6
DVP_Y7: P1.16(Y7) ; port DVP_Y7
DVP_Y8: P1.14(Y8) ; port DVP_Y8
DVP_Y9: P1.12(Y9) ; port DVP_Y9
I2C_SCL: P1.5(SCL) R24.1 ; port I2C_SCL
I2C_SDA: P1.3(SDA) R23.1 ; port I2C_SDA

Not connected (* = marked no-connect by the designer): P1 1(NC) 23(NC) 24(NC) 25(NC)

### Notes on the sheet
- https://dl.espressif.com/dl/schematics/SCH_ESP32-S3-EYE-MB_20211201_V2.2.pdf
- https://github.com/espressif/esp32-camera
- https://github.com/espressif/esp-who/blob/master/docs/en/get-started/ESP32-S3-EYE_Getting_Started_Guide.md#5-related-documents

### Library data of the parts
C24 C26 C28 = CAP 0603 4.7uF 35V: Multilayer Ceramic Capacitor, 4.7 uF, 35 V, ± 10%, X5R, 0603 [1608 Metric]; Manufacturer: Murata; Manufacturer Part Number: GRM188R6YA475KE15D; Supplier 1: LCSC; Supplier Part Number 1: C162274; RoHS: Yes; Category: Ceramic Capacitors; Stock 1: 52180; Pricing 1: 10=0.05850, 100=0.04900, 300=0.04430, 1000=0.03020, 4000=0.02820, 8000=0.02710 (USD); Mount: Surface Mount; Case/Package: 0603; Case Code (Metric): 1608; Case Code (Imperial): 0603; Weight: 0.000222oz; Material: Ceramic; Min Operating Temperature: -55°C; Max Operating Temperature: 85°C; Capacitance: 4.7uF; Tolerance: 10%; Voltage Rating: 35V; Packaging: Tape and Reel; Package Quantity: 1; Dielectric: X5R; Series: GRM; Voltage Rating (DC): 35V; Termination: SMD/SMT; Resistor Type: Ceramic; Length: 1.6mm; Width: 0.8mm; Height: 0.8mm; Thickness: 0.031inch; Depth: 0.8mm; RoHS Compliant: Yes; Lead Free: Lead Free; Reach SVHC Compliant: Yes; Value: 4.7uF
C25 C27 C29 = CAP 0603 100nF 50V: as C8 on sheet USB intrface; Supplier 1: LCSC; RoHS: Yes; Category: Ceramic Capacitors; Stock 1: 3546650; Pricing 1: 50=0.00420, 500=0.00330, 1500=0.00290, 5000=0.00260, 25000=0.00250, 50000=0.00240 (USD); Mount: Surface Mount; Case/Package: 0603; Number of Pins: 2; Case Code (Imperial): 0603; Case Code (Metric): 1608; Dielectric Material: Ceramic; Material: Ceramic; Contact Plating: Tin,Matte; Min Operating Temperature: -55°C; Max Operating Temperature: 125°C; Capacitance: 100nF; Tolerance: 10%; Packaging: Tape and Reel; Dielectric: X7R; Voltage Rating (DC): 50V; Termination: SMD/SMT; Package Quantity: 1; Voltage Rating: 50V; Length: 1.6mm; Width: 0.8mm; Height: 0.8mm; Depth: 0.8mm; Thickness: 0.035inch; Radiation Hardening: No; RoHS Compliant: Yes; REACH SVHC: No SVHC; Lead Free: Lead Free; ComponentLink1URL: https://datasheet.ciiva.com/19467/1857604-19467681.pdf?src-supplier=Jameco; ComponentLink1Description: https://datasheet.ciiva.com/19467/1857604-19467681.pdf?src-supplier=Jameco; ComponentLink2URL: https://datasheet.ciiva.com/11786/0900766b807a1cab-11786047.pdf?src-supplier=RSComponents; ComponentLink2Description: https://datasheet.ciiva.com/11786/0900766b807a1cab-11786047.pdf?src-supplier=RSComponents; ComponentLink3URL: https://datasheet.ciiva.com/29201/451744-da-01-en-vs-kondensator-0603-29201904.pdf?src-supplier=Conrad; ComponentLink3Description: https://datasheet.ciiva.com/29201/451744-da-01-en-vs-kondensator-0603-29201904.pdf?src-supplier=Conrad; ComponentLink4URL: https://datasheet.ciiva.com/7937/4360-7937659.pdf?src-supplier=Element14; ComponentLink4Description: https://datasheet.ciiva.com/7937/4360-7937659.pdf?src-supplier=Element14; ComponentLink5URL: https://datasheet.ciiva.com/14116/nmgrm-data-en-14116602.pdf?src-supplier=Distrelec; ComponentLink5Description: https://datasheet.ciiva.com/14116/nmgrm-data-en-14116602.pdf?src-supplier=Distrelec; ComponentLink6URL: https://datasheet.ciiva.com/48436/nmgrm-data-en-48436667.pdf?src-supplier=Distrelec; ComponentLink6Description: https://datasheet.ciiva.com/48436/nmgrm-data-en-48436667.pdf?src-supplier=Distrelec; ComponentLink7URL: https://datasheet.ciiva.com/28534/4360-28534245.pdf?src-supplier=Element14; ComponentLink7Description: https://datasheet.ciiva.com/28534/4360-28534245.pdf?src-supplier=Element14; ComponentLink8URL: https://datasheet.ciiva.com/131/partnumbering-e-01-131739.pdf?src-supplier=Digi-Key; ComponentLink8Description: https://datasheet.ciiva.com/131/partnumbering-e-01-131739.pdf?src-supplier=Digi-Key; ComponentLink9URL: https://datasheet.ciiva.com/131/partnumbering-e-01-131738.pdf?src-supplier=Digi-Key; ComponentLink9Description: https://datasheet.ciiva.com/131/partnumbering-e-01-131738.pdf?src-supplier=Digi-Key; ComponentLink10URL: https://datasheet.ciiva.com/131/partnumbering-e-01-131740.pdf?src-supplier=Digi-Key; ComponentLink10Description: https://datasheet.ciiva.com/131/partnumbering-e-01-131740.pdf?src-supplier=Digi-Key; ComponentLink11URL: https://datasheet.ciiva.com/7937/1747470-7937658.pdf?src-supplier=Element14; ComponentLink11Description: https://datasheet.ciiva.com/7937/1747470-7937658.pdf?src-supplier=Element14; Supplier Part Number 1: C77055; Value: 100nF
P1 = FPC camera module: OV9655 FPC24 1.3Mp CMOS Camera Module / + Clamshell 24 Bottom Contact Surface Mount 0.5mm SMD,P=0.5mm FFC/FPC Connectors ROHS; Manufacturer: JUSHUO; ManufacturerPartNumber: AFC01-S24FCA-00; Supplier: LCSC; SupplierPartNumber: C262669
R23-R26 = RES 0603 10k 1%: Res Thick Film 0603 10K Ohm 1% 1/10W ±100ppm/°C Molded SMD Punched Carrier T/R; Manufacturer: Panasonic; Manufacturer Part Number: ERJ-3EKF1002V; Max Power Dissipation: 100mW; Voltage Rating: 75V; Supplier 1: LCSC; RoHS: Yes; Category: Chip SMD Resistors; Stock 1: 555600; Pricing 1: 50=0.010200, 500=0.008400, 1500=0.007300, 5000=0.006100, 25000=0.005500, 50000=0.005400 (AUD); Mount: Surface Mount; Case/Package: 0603; Number of Pins: 2; Case Code (Metric): 1608; Case Code (Imperial): 0603; Contact Plating: Tin; Size Code: 0603; Min Operating Temperature: -55°C; Max Operating Temperature: 155°C; Resistance: 10kR; Packaging: Tape and Reel; Resistor Type: Thick Film; Temperature Coefficient: 100ppm/°C; Tolerance: 1%; Number of Terminations: 2; Series: ERJ; Construction: Rectangular; Power Rating: 100mW; Features: Automotive AEC-Q200; Voltage Rating (DC): 75V; Package Quantity: 1; Resistance Tolerance: 1%; Termination: SMD/SMT; Technology: THICK FILM; Length: 1.6mm; Width: 0.031inch; Height: 0.45mm; Depth: 0.8mm; Radiation Hardening: No; RoHS Compliant: Yes; Military Standard: Not; Lead Free: Lead Free; REACH SVHC: No SVHC; ComponentLink1URL: https://datasheet.ciiva.com/7830/aoa0000ce2-7830729.pdf?src-supplier=Element14; ComponentLink1Description: https://datasheet.ciiva.com/7830/aoa0000ce2-7830729.pdf?src-supplier=Element14; ComponentLink2URL: https://datasheet.ciiva.com/46372/1678782-46372725.pdf?src-supplier=Element14; ComponentLink2Description: https://datasheet.ciiva.com/46372/1678782-46372725.pdf?src-supplier=Element14; ComponentLink3URL: https://datasheet.ciiva.com/28514/426256-28514198.pdf?src-supplier=Element14; ComponentLink3Description: https://datasheet.ciiva.com/28514/426256-28514198.pdf?src-supplier=Element14; ComponentLink4URL: https://datasheet.ciiva.com/24070/aoa0000ce2-24070318.pdf?src-supplier=Mouser; ComponentLink4Description: https://datasheet.ciiva.com/24070/aoa0000ce2-24070318.pdf?src-supplier=Mouser; ComponentLink5URL: https://datasheet.ciiva.com/16759/70260748-16759807.pdf?src-supplier=Allied+Electronics; ComponentLink5Description: https://datasheet.ciiva.com/16759/70260748-16759807.pdf?src-supplier=Allied+Electronics; ComponentLink6URL: https://datasheet.ciiva.com/9194/aoa0000ce2-9194199.pdf?src-supplier=Avnet; ComponentLink6Description: https://datasheet.ciiva.com/9194/aoa0000ce2-9194199.pdf?src-supplier=Avnet; ComponentLink7URL: https://datasheet.ciiva.com/48530/aoa0000ce2-48530988.pdf?src-supplier=Avnet; ComponentLink7Description: https://datasheet.ciiva.com/48530/aoa0000ce2-48530988.pdf?src-supplier=Avnet; ComponentLink8URL: https://datasheet.ciiva.com/30208/aoa0000ce2-30208985.pdf?src-supplier=Onlinecomponents.com; ComponentLink8Description: https://datasheet.ciiva.com/30208/aoa0000ce2-30208985.pdf?src-supplier=Onlinecomponents.com; Supplier Part Number 1: C191124

## Sheet ESP32-S3.SchDoc
size A3; SheetNumber: 3; SheetTotal: 9
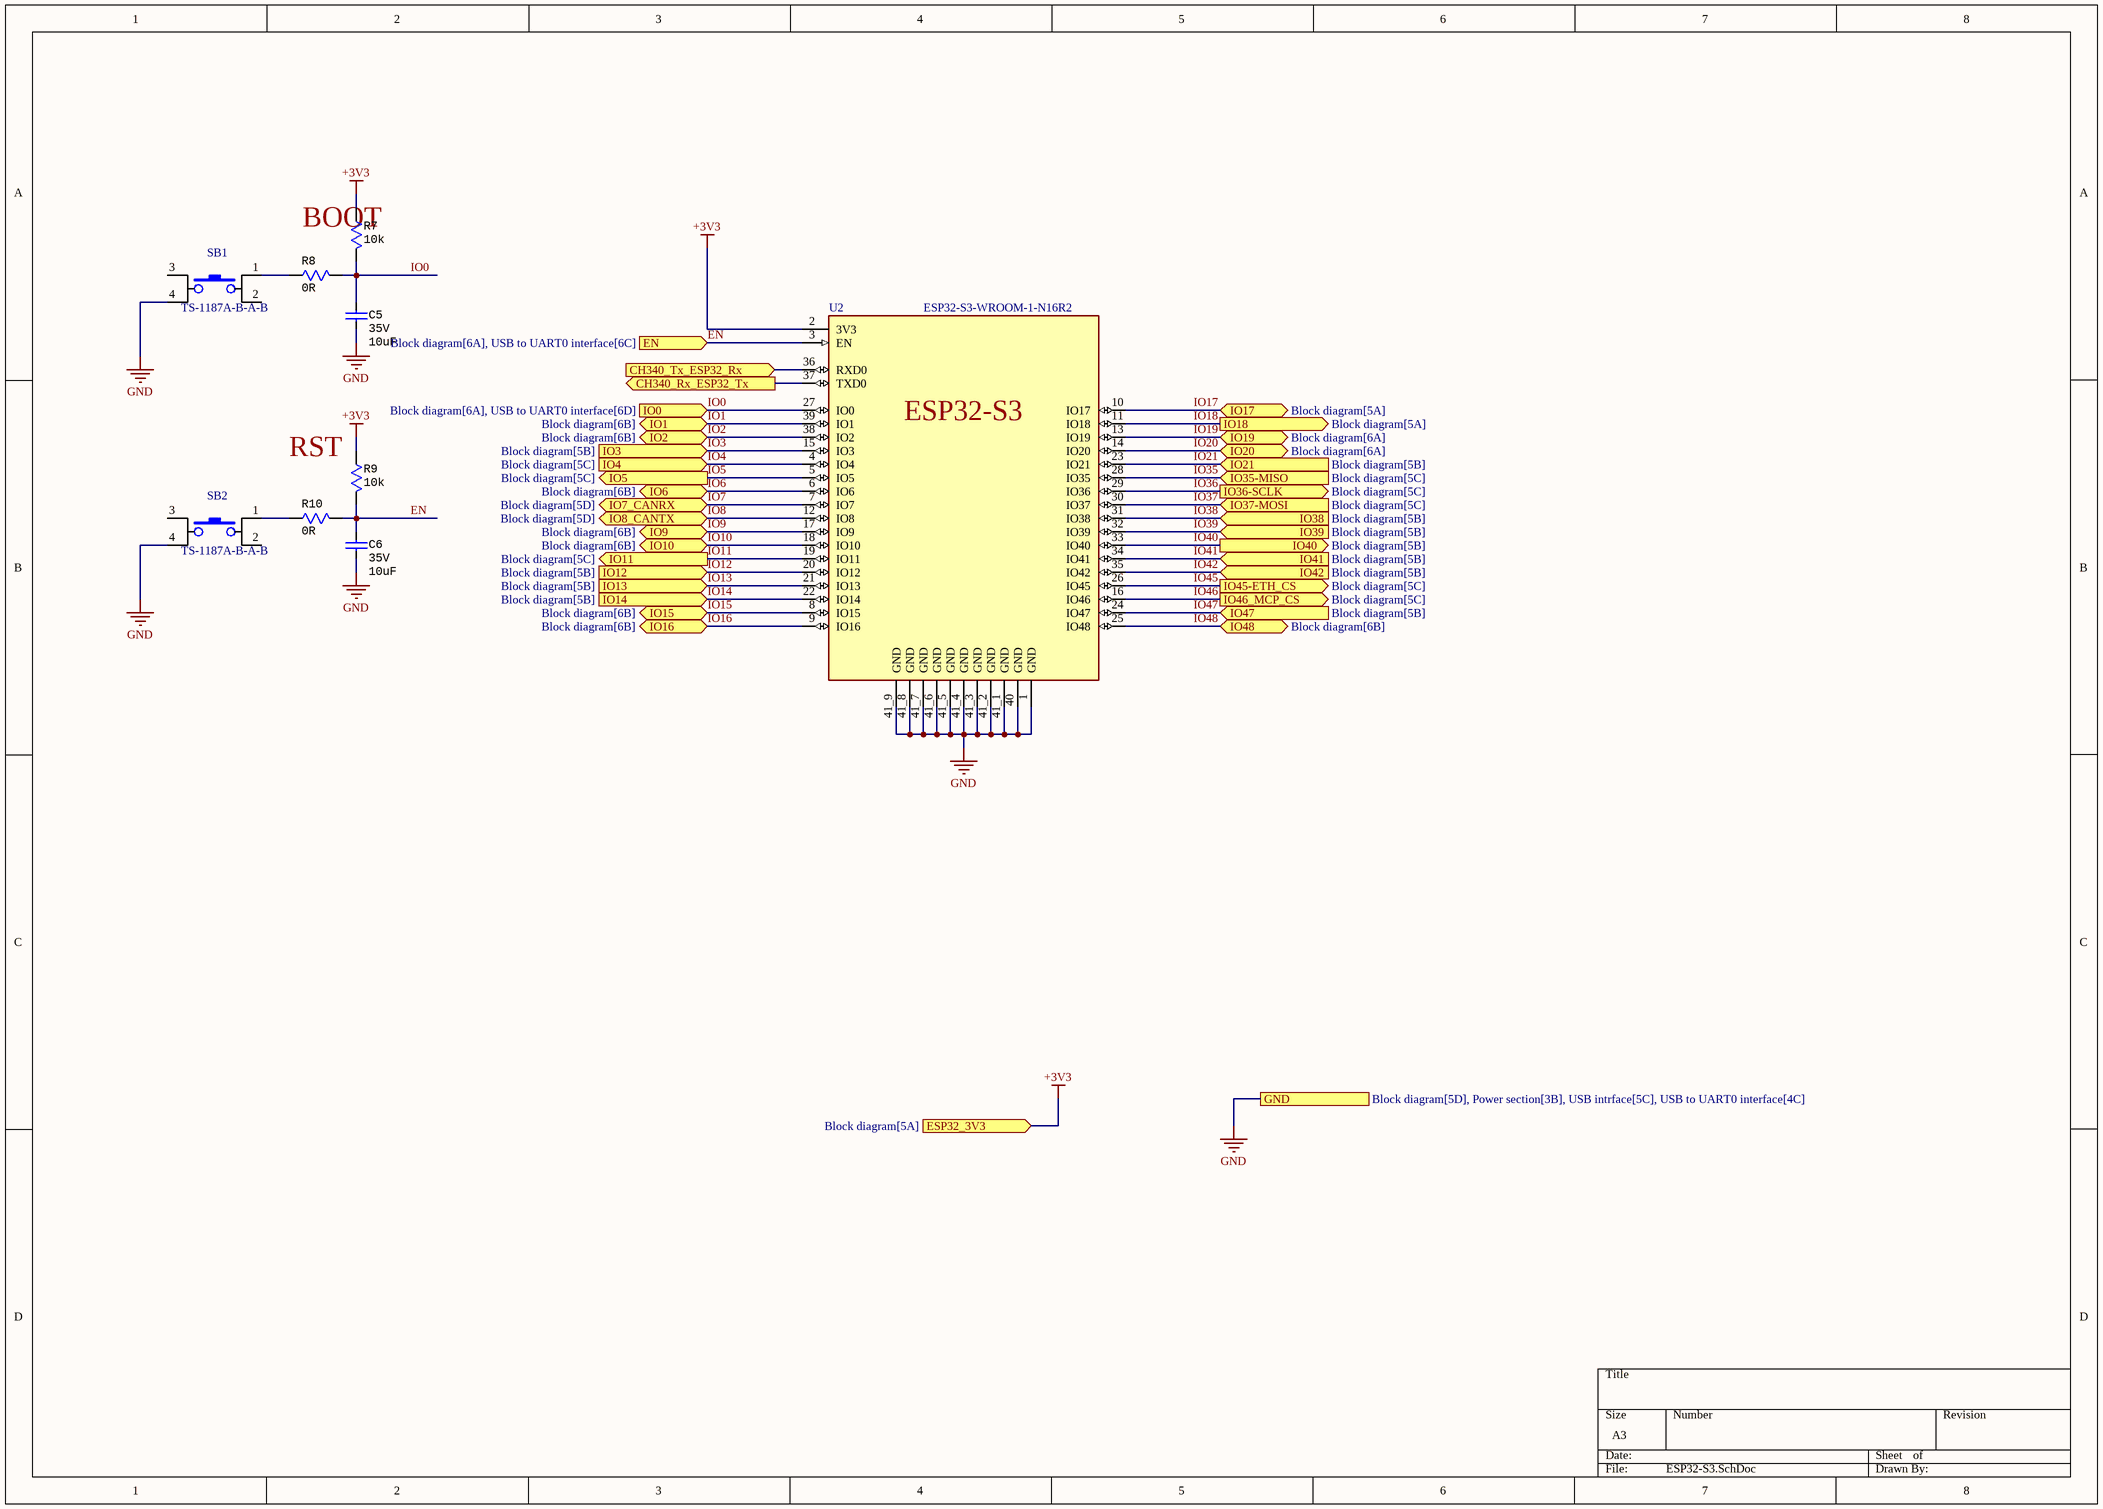
[diagram p3: ESP32-S3.SchDoc]

### Parts
C5  Voltage: 35V  [CAP Ceramic SMD 0603]  (hidden comment: 10uF)
C6  Voltage: 35V  [CAP Ceramic SMD 0603]  (hidden comment: 10uF)
R7  value 10k  [RES SMD 0603]  (hidden comment: 10kR)
R8  0R  [RES SMD 0603]
R9  value 10k  [RES SMD 0603]  (hidden comment: 10kR)
R10  0R  [RES SMD 0603]
SB1  TS-1187A-B-A-B  [SW-SMD-4X4X1.5]
SB2  TS-1187A-B-A-B  [SW-SMD-4X4X1.5]
U2  ESP32-S3-WROOM-1-N16R2  [ESP32-S3-WROOM-1-N16R2]

### Ports
CH340_Rx_ESP32_Tx (out, see Block diagram[6A], USB to UART0 interface[4B]), CH340_Tx_ESP32_Rx (in, see Block diagram[6A], USB to UART0 interface[4B]), EN (in, see Block diagram[6A], USB to UART0 interface[6C]), ESP32_3V3 (in, see Block diagram[5A]), GND (see Block diagram[5D], Power section[3B], USB intrface[5C], USB to UART0 interface[4C]), IO0 (in, see Block diagram[6A], USB to UART0 interface[6D]), IO1 (bidir, see Block diagram[6B]), IO2 (bidir, see Block diagram[6B]), IO3 (in, see Block diagram[5B]), IO4 (in, see Block diagram[5C]), IO5 (out, see Block diagram[5C]), IO6 (bidir, see Block diagram[6B]), IO7_CANRX (bidir, see Block diagram[5D]), IO8_CANTX (bidir, see Block diagram[5D]), IO9 (bidir, see Block diagram[6B]), IO10 (bidir, see Block diagram[6B]), IO11 (out, see Block diagram[5C]), IO12 (in, see Block diagram[5B]), IO13 (in, see Block diagram[5B]), IO14 (in, see Block diagram[5B]), IO15 (bidir, see Block diagram[6B]), IO16 (bidir, see Block diagram[6B]), IO17 (bidir, see Block diagram[5A]), IO18 (out, see Block diagram[5A]), IO19 (bidir, see Block diagram[6A]), IO20 (bidir, see Block diagram[6A]), IO21 (in, see Block diagram[5B]), IO35-MISO (in, see Block diagram[5C]), IO36-SCLK (out, see Block diagram[5C]), IO37-MOSI (in, see Block diagram[5C]), IO38 (in, see Block diagram[5B]), IO39 (in, see Block diagram[5B]), IO40 (out, see Block diagram[5B]), IO41 (in, see Block diagram[5B]), IO42 (in, see Block diagram[5B]), IO45-ETH_CS (out, see Block diagram[5C]), IO46_MCP_CS (out, see Block diagram[5C]), IO47 (in, see Block diagram[5B]), IO48 (bidir, see Block diagram[6B])

### Nets
+3V3: R7.2 R9.2 U2.2(3V3) ; port ESP32_3V3
GND: C5.1 C6.1 SB1.4 SB2.4 U2.1(GND) U2.40(GND) U2.41_1(GND) U2.41_2(GND) U2.41_3(GND) U2.41_4(GND) U2.41_5(GND) U2.41_6(GND) U2.41_7(GND) U2.41_8(GND) U2.41_9(GND) ; port GND
CH340_Rx_ESP32_Tx: U2.37(TXD0) ; port CH340_Rx_ESP32_Tx
CH340_Tx_ESP32_Rx: U2.36(RXD0) ; port CH340_Tx_ESP32_Rx
EN: C6.2 R9.1 R10.1 U2.3(EN) ; port EN
IO0: C5.2 R7.1 R8.1 U2.27(IO0) ; port IO0
IO1: U2.39(IO1) ; port IO1  [project net IO0]
IO2: U2.38(IO2) ; port IO2
IO3: U2.15(IO3) ; port IO3  [project net DVP_Y5]
IO4: U2.4(IO4) ; port IO4  [project net ETH_~{INT}]
IO5: U2.5(IO5) ; port IO5  [project net ETH_~{RST}]
IO6: U2.6(IO6) ; port IO6
IO7: U2.7(IO7) ; port IO7_CANRX  [project net CAN_RX]
IO8: U2.12(IO8) ; port IO8_CANTX  [project net CAN_TX]
IO9: U2.17(IO9) ; port IO9
IO10: U2.18(IO10) ; port IO10
IO11: U2.19(IO11) ; port IO11  [project net DVP_PCLK]
IO12: U2.20(IO12) ; port IO12  [project net DVP_Y6]
IO13: U2.21(IO13) ; port IO13  [project net DVP_Y2]
IO14: U2.22(IO14) ; port IO14  [project net DVP_Y4]
IO15: U2.8(IO15) ; port IO15
IO16: U2.9(IO16) ; port IO16
IO17: U2.10(IO17) ; port IO17  [project net I2C_SDA]
IO18: U2.11(IO18) ; port IO18  [project net I2C_SCL]
IO19: U2.13(IO19) ; port IO19  [project net ESP32_USB_n]
IO20: U2.14(IO20) ; port IO20  [project net ESP32_USB_p]
IO21: U2.23(IO21) ; port IO21  [project net DVP_VSYNC]
IO35: U2.28(IO35) ; port IO35-MISO  [project net ETH_MISO]
IO36: U2.29(IO36) ; port IO36-SCLK  [project net ETH_SCLK]
IO37: U2.30(IO37) ; port IO37-MOSI  [project net ETH_MOSI]
IO38: U2.31(IO38) ; port IO38  [project net DVP_HREF]
IO39: U2.32(IO39) ; port IO39  [project net DVP_Y9]
IO40: U2.33(IO40) ; port IO40  [project net DVP_XCLK]
IO41: U2.34(IO41) ; port IO41  [project net DVP_Y8]
IO42: U2.35(IO42) ; port IO42  [project net DVP_Y7]
IO45: U2.26(IO45) ; port IO45-ETH_CS  [project net ETH_CS]
IO46: U2.16(IO46) ; port IO46_MCP_CS
IO47: U2.24(IO47) ; port IO47  [project net DVP_Y3]
IO48: U2.25(IO48) ; port IO48
NetR8_2: R8.2 SB1.1
NetR10_2: R10.2 SB2.1

Not connected (* = marked no-connect by the designer): SB1 2 3; SB2 2 3

### Notes on the sheet
- BOOT
- RST
- (in symbol ESP32-S3-WROOM-1-N16R2) ESP32-S3

### Library data of the parts
C5 C6 = CAP 0603 10uF 35V: as C7 on sheet USB intrface; Supplier 1: LCSC; RoHS: Yes; Category: Ceramic Capacitors; Mount: Surface Mount; Case/Package: 0603; Case Code (Metric): 1608; Case Code (Imperial): 0603; Min Operating Temperature: -55°C; Max Operating Temperature: 85°C; Packaging: Tape and Reel; Capacitance: 10uF; Voltage Rating: 35V; Tolerance: 20%; Dielectric: X5R; Voltage Rating (DC): 35V; Length: 0.063inch; Width: 0.031inch; Thickness: 0.039inch; RoHS Compliant: Yes; ComponentLink1URL: http://search.murata.co.jp/Ceramy/image/img/A01X/G101/ENG/GRM188R6YA106MA73-01.pdf?src-supplier=Future+Electronics; ComponentLink1Description: http://search.murata.co.jp/Ceramy/image/img/A01X/G101/ENG/GRM188R6YA106MA73-01.pdf?src-supplier=Future+Electronics; ComponentLink2URL: http://search.murata.co.jp/Ceramy/image/img/A01X/G101/ENG/GRM188R6YA106MA73-01.pdf?src-supplier=Digi-Key; ComponentLink2Description: http://search.murata.co.jp/Ceramy/image/img/A01X/G101/ENG/GRM188R6YA106MA73-01.pdf?src-supplier=Digi-Key; ComponentLink3URL: https://www.murata.com/~/media/webrenewal/support/library/catalog/products/capacitor/mlcc/c02e.ashx?la=en-us&src-supplier=Digi-Key; ComponentLink3Description: https://www.murata.com/~/media/webrenewal/support/library/catalog/products/capacitor/mlcc/c02e.ashx?la=en-us&src-supplier=Digi-Key; ComponentLink4URL: http://search.murata.co.jp/Ceramy/image/img/A01X/G101/ENG/GRM188R6YA106MA73-01.pdf?src-supplier=Mouser; ComponentLink4Description: http://search.murata.co.jp/Ceramy/image/img/A01X/G101/ENG/GRM188R6YA106MA73-01.pdf?src-supplier=Mouser; ComponentLink5URL: http://search.murata.co.jp/Ceramy/image/img/A01X/G101/ENG/GRM188R6YA106MA73-01.pdf?src-supplier=TTI; ComponentLink5Description: http://search.murata.co.jp/Ceramy/image/img/A01X/G101/ENG/GRM188R6YA106MA73-01.pdf?src-supplier=TTI; Supplier Part Number 1: C194427; Value: 10uF
R7 R9 = RES 0603 10k 1%: as R23 on sheet Camera module; Supplier 1: LCSC; RoHS: Yes; Category: Chip SMD Resistors; Stock 1: 555600; Pricing 1: 50=0.010200, 500=0.008400, 1500=0.007300, 5000=0.006100, 25000=0.005500, 50000=0.005400 (AUD); Mount: Surface Mount; Case/Package: 0603; Number of Pins: 2; Case Code (Metric): 1608; Case Code (Imperial): 0603; Contact Plating: Tin; Size Code: 0603; Min Operating Temperature: -55°C; Max Operating Temperature: 155°C; Resistance: 10kR; Packaging: Tape and Reel; Resistor Type: Thick Film; Temperature Coefficient: 100ppm/°C; Tolerance: 1%; Number of Terminations: 2; Series: ERJ; Construction: Rectangular; Power Rating: 100mW; Features: Automotive AEC-Q200; Voltage Rating (DC): 75V; Package Quantity: 1; Resistance Tolerance: 1%; Termination: SMD/SMT; Technology: THICK FILM; Length: 1.6mm; Width: 0.031inch; Height: 0.45mm; Depth: 0.8mm; Radiation Hardening: No; RoHS Compliant: Yes; Military Standard: Not; Lead Free: Lead Free; REACH SVHC: No SVHC; ComponentLink1URL: https://datasheet.ciiva.com/7830/aoa0000ce2-7830729.pdf?src-supplier=Element14; ComponentLink1Description: https://datasheet.ciiva.com/7830/aoa0000ce2-7830729.pdf?src-supplier=Element14; ComponentLink2URL: https://datasheet.ciiva.com/46372/1678782-46372725.pdf?src-supplier=Element14; ComponentLink2Description: https://datasheet.ciiva.com/46372/1678782-46372725.pdf?src-supplier=Element14; ComponentLink3URL: https://datasheet.ciiva.com/28514/426256-28514198.pdf?src-supplier=Element14; ComponentLink3Description: https://datasheet.ciiva.com/28514/426256-28514198.pdf?src-supplier=Element14; ComponentLink4URL: https://datasheet.ciiva.com/24070/aoa0000ce2-24070318.pdf?src-supplier=Mouser; ComponentLink4Description: https://datasheet.ciiva.com/24070/aoa0000ce2-24070318.pdf?src-supplier=Mouser; ComponentLink5URL: https://datasheet.ciiva.com/16759/70260748-16759807.pdf?src-supplier=Allied+Electronics; ComponentLink5Description: https://datasheet.ciiva.com/16759/70260748-16759807.pdf?src-supplier=Allied+Electronics; ComponentLink6URL: https://datasheet.ciiva.com/9194/aoa0000ce2-9194199.pdf?src-supplier=Avnet; ComponentLink6Description: https://datasheet.ciiva.com/9194/aoa0000ce2-9194199.pdf?src-supplier=Avnet; ComponentLink7URL: https://datasheet.ciiva.com/48530/aoa0000ce2-48530988.pdf?src-supplier=Avnet; ComponentLink7Description: https://datasheet.ciiva.com/48530/aoa0000ce2-48530988.pdf?src-supplier=Avnet; ComponentLink8URL: https://datasheet.ciiva.com/30208/aoa0000ce2-30208985.pdf?src-supplier=Onlinecomponents.com; ComponentLink8Description: https://datasheet.ciiva.com/30208/aoa0000ce2-30208985.pdf?src-supplier=Onlinecomponents.com; Supplier Part Number 1: C191124
R8 R10 = RES 0603 0R 1%: ERJ Series 0603 0 Ohm 0.05 W Jumper Surface Mount Thick Film Chip Resistor; Manufacturer: Panasonic; Manufacturer Part Number: ERJ-3GEY0R00V; Tolerance: 1%; Max Power Dissipation: 100mW; Voltage Rating (DC): 50V; Temperature Coefficient: 600ppm/°C; Voltage Rating: 75V; Supplier 1: Arrow Electronics; RoHS: Yes; Category: Chip SMD Resistors; Stock 1: 3440000; Pricing 1: 5000=0.00480 (USD); Mount: Surface Mount; Case/Package: 0603; Case Code (Metric): 1608; Case Code (Imperial): 0603; Contact Plating: Tin; Size Code: 0603; Min Operating Temperature: -55°C; Max Operating Temperature: 155°C; Packaging: Tape and Reel; Resistance: 0R; Resistor Type: Thick Film; Number of Terminations: 2; Series: ERJ; Power Rating: 100mW; Package Quantity: 1; Construction: Rectangular; Termination: SMD/SMT; Features: Automotive AEC-Q200; Technology: THICK FILM; Length: 1.6mm; Width: 0.031inch; Height: 0.45mm; Depth: 0.8mm; Radiation Hardening: No; RoHS Compliant: Yes; Lead Free: Lead Free; Military Standard: Not; REACH SVHC: No SVHC; ComponentLink1URL: https://datasheet.ciiva.com/27055/1935748-27055113.pdf?src-supplier=Jameco; ComponentLink1Description: https://datasheet.ciiva.com/27055/1935748-27055113.pdf?src-supplier=Jameco; ComponentLink2URL: https://datasheet.ciiva.com/11808/0900766b80f806dd-11808207.pdf?src-supplier=RSComponents; ComponentLink2Description: https://datasheet.ciiva.com/11808/0900766b80f806dd-11808207.pdf?src-supplier=RSComponents; ComponentLink3URL: https://datasheet.ciiva.com/48532/aoa0000ce1-48532165.pdf?src-supplier=Avnet; ComponentLink3Description: https://datasheet.ciiva.com/48532/aoa0000ce1-48532165.pdf?src-supplier=Avnet; ComponentLink4URL: https://datasheet.ciiva.com/43460/1678796-43460647.pdf?src-supplier=Farnell; ComponentLink4Description: https://datasheet.ciiva.com/43460/1678796-43460647.pdf?src-supplier=Farnell; ComponentLink5URL: https://datasheet.ciiva.com/28695/1678796-28695833.pdf?src-supplier=Element14; ComponentLink5Description: https://datasheet.ciiva.com/28695/1678796-28695833.pdf?src-supplier=Element14; ComponentLink6URL: https://datasheet.ciiva.com/5959/1678796-5959707.pdf?src-supplier=Farnell; ComponentLink6Description: https://datasheet.ciiva.com/5959/1678796-5959707.pdf?src-supplier=Farnell; ComponentLink7URL: https://datasheet.ciiva.com/16834/aoa0000ce1-16834828.pdf?src-supplier=Future+Electronics; ComponentLink7Description: https://datasheet.ciiva.com/16834/aoa0000ce1-16834828.pdf?src-supplier=Future+Electronics; ComponentLink8URL: https://datasheet.ciiva.com/46377/1678796-46377868.pdf?src-supplier=Element14; ComponentLink8Description: https://datasheet.ciiva.com/46377/1678796-46377868.pdf?src-supplier=Element14; ComponentLink9URL: https://datasheet.ciiva.com/30199/4aoa0000ce1-30199822.pdf?src-supplier=Onlinecomponents.com; ComponentLink9Description: https://datasheet.ciiva.com/30199/4aoa0000ce1-30199822.pdf?src-supplier=Onlinecomponents.com; ComponentLink10URL: https://datasheet.ciiva.com/9198/aoa0000ce1-9198975.pdf?src-supplier=Avnet; ComponentLink10Description: https://datasheet.ciiva.com/9198/aoa0000ce1-9198975.pdf?src-supplier=Avnet; ComponentLink11URL: https://datasheet.ciiva.com/16758/70255313-16758527.pdf?src-supplier=Allied+Electronics; ComponentLink11Description: https://datasheet.ciiva.com/16758/70255313-16758527.pdf?src-supplier=Allied+Electronics; Supplier Part Number 1: ERJ-3GEY0R00V; Supplier 2: LCSC; Stock 2: 79900; Pricing 2: 50=0.00820, 500=0.00670, 1500=0.00590, 5000=0.00540, 25000=0.00500, 50000=0.00480 (USD); ComponentLink12URL: https://datasheet.ciiva.com/22730/1678796-22730749.pdf?src-supplier=Element14; ComponentLink12Description: https://datasheet.ciiva.com/22730/1678796-22730749.pdf?src-supplier=Element14; Supplier Part Number 2: C716999; Value: 0R
U2 = ESP32-S3-WROOM-1-N16R2: WiFi-Modul 802.11/BT 2, 4-2, 5GHz 150Mb/s; Manufacturer: Espressif Systems; Supplier 1: LCSC; Manufacturer Part Number: ESP32-S3-WROOM-1-N16R2; RoHS: No; Category: Uncategorized; Stock 1: 710; Pricing 1: 1=4.10300, 10=4.10300, 30=4.00600, 32=4.00600, 34=4.00600, 36=4.00600 (USD); Supplier Part Number 1: C2913205
SB1 SB2 = TS-1187A-B-A-B: Manufacturer: *; Part Number: *; Supplier: *; Supplier part number: *; Supplier 1: LCSC; Supplier Part Number 1: C318884; Manufacturer Part Number: TS-1187A-B-A-B; RoHS: No; Category: Uncategorized; Stock 1: 372850; Pricing 1: 50=0.01550, 500=0.01200, 1500=0.01040, 4000=0.00920, 24000=0.00870, 48000=0.00840 (USD)